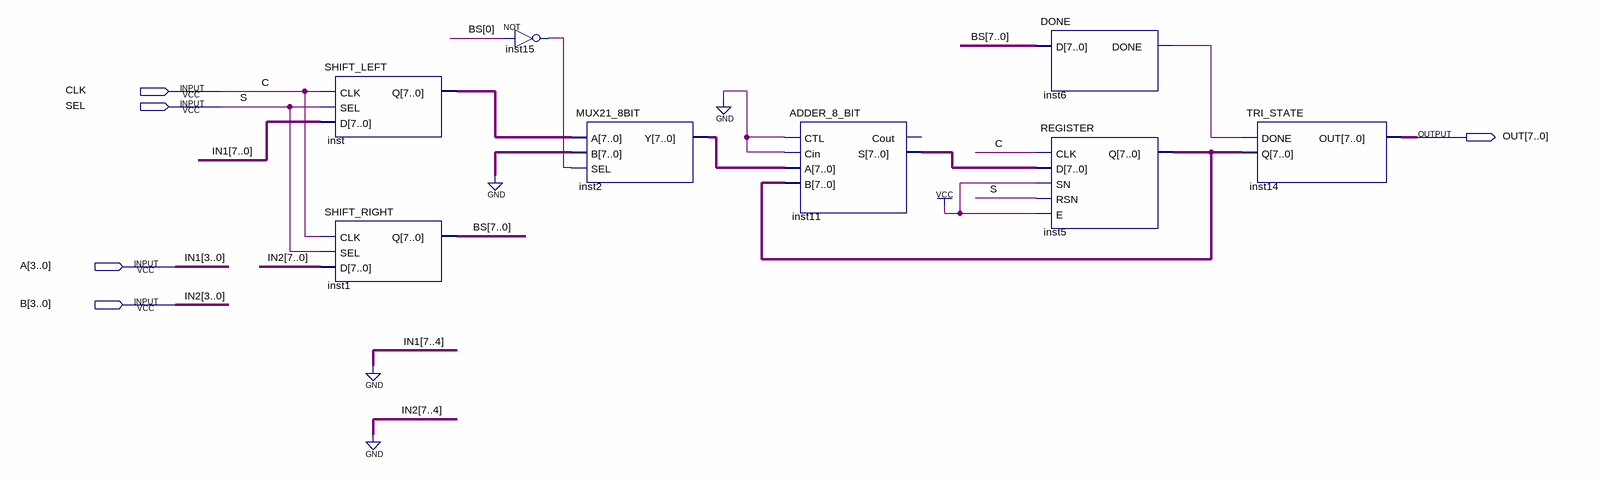
[diagram p0: schematic sheet]
// Quartus schematic MULTIPLY.bdf as structural Verilog: 8 symbols, 5 pins
module MULTIPLY (
  input  CLK,
  input  SEL,
  input  [3:0] A,
  input  [3:0] B,
  output [7:0] OUT
);

  wire inst6_done, inst15_out;
  wire [7:0] BS, inst2_y, inst5_q, inst11_s, inst_q;

  SHIFT_LEFT inst (.CLK(CLK), .SEL(SEL), .D({4'b0000, A}), .Q(inst_q));
  SHIFT_RIGHT inst1 (.CLK(CLK), .SEL(SEL), .D({4'b0000, B}), .Q(BS));
  not inst15 (inst15_out, BS[0]);
  MUX21_8BIT inst2 (.A(inst_q), .B({8{1'b0}}), .SEL(inst15_out), .Y(inst2_y));
  ADDER_8_BIT inst11 (.CTL(1'b0), .Cin(1'b0), .A(inst2_y), .B(inst5_q), .S(inst11_s));  // open: Cout
  DONE inst6 (.D(BS), .DONE(inst6_done));
  REGISTER inst5 (.CLK(CLK), .D(inst11_s), .SN(1'b1), .RSN(SEL), .E(1'b1), .Q(inst5_q));
  TRI_STATE inst14 (.DONE(inst6_done), .Q(inst5_q), .OUT(OUT));

  // Other names for the same wires on the sheet: C = CLK; IN1[3:0] = A; IN2[3:0] = B; S = SEL
endmodule
